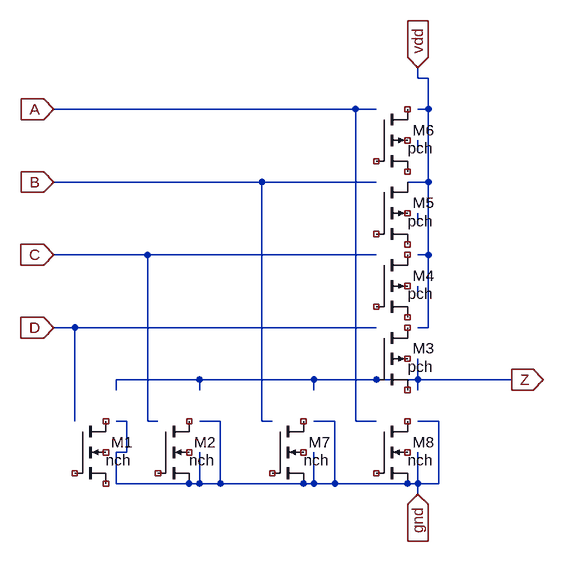
[diagram p0: schematic mynor4.asc]
mynor4.asc, the LTspice schematic file:
Version 4
SHEET 1 880 680
WIRE 240 -256 240 -272
WIRE 256 -256 240 -256
WIRE 144 -208 -320 -208
WIRE 176 -208 144 -208
WIRE 256 -208 256 -256
WIRE 256 -208 240 -208
WIRE 240 -144 240 -160
WIRE 0 -96 -320 -96
WIRE 176 -96 0 -96
WIRE 240 -96 224 -96
WIRE 256 -96 256 -208
WIRE 256 -96 240 -96
WIRE 240 -32 240 -48
WIRE -176 16 -320 16
WIRE 176 16 -176 16
WIRE 256 16 256 -96
WIRE 256 16 240 16
WIRE 240 80 240 64
WIRE -288 128 -320 128
WIRE 176 128 -288 128
WIRE 256 128 256 16
WIRE 256 128 240 128
WIRE -96 208 -224 208
WIRE 80 208 -96 208
WIRE 240 208 240 176
WIRE 240 208 80 208
WIRE 384 208 240 208
WIRE -224 224 -224 208
WIRE -96 224 -96 208
WIRE 80 224 80 208
WIRE 240 224 240 208
WIRE -288 272 -288 128
WIRE -208 272 -224 272
WIRE -176 272 -176 16
WIRE -160 272 -176 272
WIRE -64 272 -96 272
WIRE 0 272 0 -96
WIRE 16 272 0 272
WIRE 112 272 80 272
WIRE 144 272 144 -208
WIRE 176 272 144 272
WIRE 272 272 240 272
WIRE -208 320 -208 272
WIRE -208 320 -224 320
WIRE -224 368 -224 320
WIRE -96 368 -96 320
WIRE -96 368 -224 368
WIRE -64 368 -64 272
WIRE -64 368 -96 368
WIRE 80 368 80 320
WIRE 80 368 -64 368
WIRE 112 368 112 272
WIRE 112 368 80 368
WIRE 240 368 240 320
WIRE 240 368 112 368
WIRE 272 368 272 272
WIRE 272 368 240 368
WIRE 240 384 240 368
FLAG -320 16 C
IOPIN -320 16 In
FLAG -320 128 D
IOPIN -320 128 In
FLAG 384 208 Z
IOPIN 384 208 Out
FLAG 240 384 gnd
IOPIN 240 384 In
FLAG -320 -208 A
IOPIN -320 -208 In
FLAG -320 -96 B
IOPIN -320 -96 In
FLAG 240 -272 vdd
IOPIN 240 -272 In
SYMBOL nmos4 -288 272 R0
WINDOW 3 48 60 Left 2
SYMATTR InstName M1
SYMATTR Value nch
SYMATTR Value2 l=2u w=6u
SYMBOL nmos4 -160 272 R0
WINDOW 3 48 60 Left 2
SYMATTR InstName M2
SYMATTR Value nch
SYMATTR Value2 l=2u w=6u
SYMBOL pmos4 176 128 R0
WINDOW 3 48 60 Left 2
SYMATTR InstName M3
SYMATTR Value pch
SYMATTR Value2 l=2u w=18u
SYMBOL pmos4 176 16 R0
WINDOW 3 48 60 Left 2
SYMATTR InstName M4
SYMATTR Value pch
SYMATTR Value2 l=2u w=18u
SYMBOL pmos4 176 -96 R0
WINDOW 3 48 60 Left 2
SYMATTR InstName M5
SYMATTR Value pch
SYMATTR Value2 l=2u w=18u
SYMBOL pmos4 176 -208 R0
WINDOW 3 48 60 Left 2
SYMATTR InstName M6
SYMATTR Value pch
SYMATTR Value2 l=2u w=18u
SYMBOL nmos4 16 272 R0
WINDOW 3 48 60 Left 2
SYMATTR InstName M7
SYMATTR Value nch
SYMATTR Value2 l=2u w=6u
SYMBOL nmos4 176 272 R0
WINDOW 3 48 60 Left 2
SYMATTR InstName M8
SYMATTR Value nch
SYMATTR Value2 l=2u w=6u

The netlist it stands for:
* mynor4.asc
* M1: nch l=2u w=6u (symbol nmos4 not certain, pin order unknown); nets seen at it: 
* M2: nch l=2u w=6u (symbol nmos4 not certain, pin order unknown); nets seen at it: gnd
* M3: pch l=2u w=18u (symbol pmos4 not certain, pin order unknown); nets seen at it: Z
* M4: pch l=2u w=18u (symbol pmos4 not certain, pin order unknown); nets seen at it: 
* M5: pch l=2u w=18u (symbol pmos4 not certain, pin order unknown); nets seen at it: vdd
* M6: pch l=2u w=18u (symbol pmos4 not certain, pin order unknown); nets seen at it: 
* M7: nch l=2u w=6u (symbol nmos4 not certain, pin order unknown); nets seen at it: gnd
* M8: nch l=2u w=6u (symbol nmos4 not certain, pin order unknown); nets seen at it: gnd
.backanno
.end